# Altium project Carrier-Board-v1.0.PrjPcb (part 4 of 15)

## Sheet MICRO_SD_INTERFACE.SchDoc
size A4; SheetNumber: 7; SheetTotal: 27
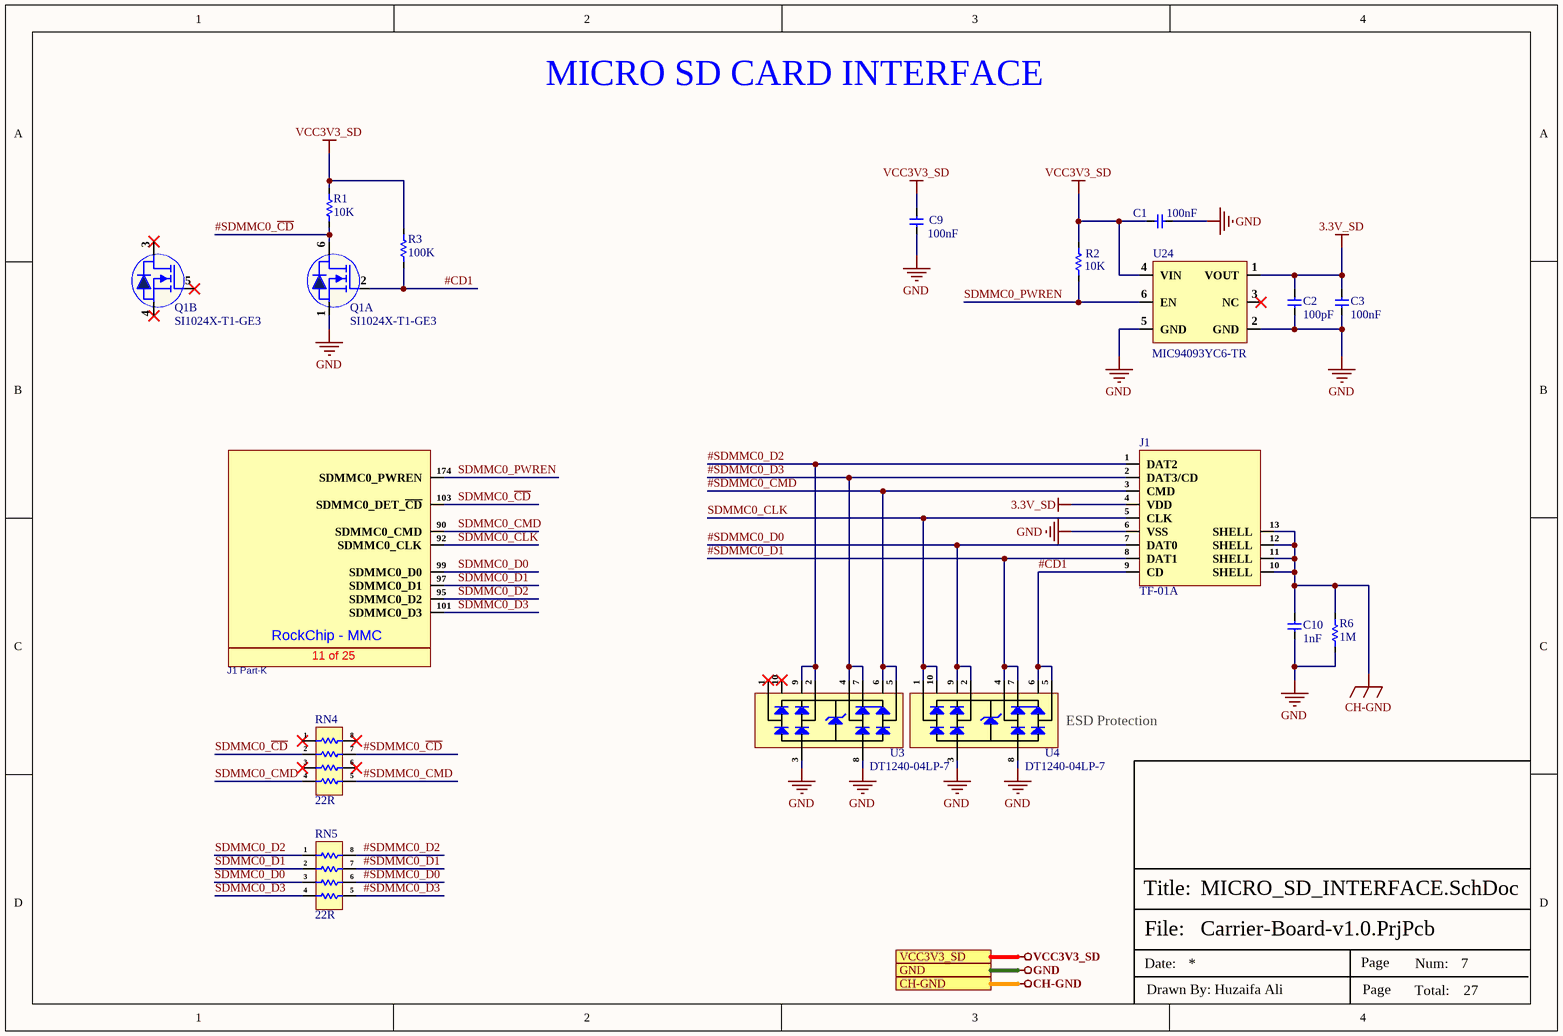
[diagram p6: MICRO_SD_INTERFACE.SchDoc]

### Parts
C1  100nF  [Cap-0402]
C2  100pF  [Cap-0402]
C3  100nF  [Cap-0402]
C9  100nF  [Cap-0402]
C10  1nF  [Cap-1206]
J1  TF-01A  [TF-01A]
J1_Part-  AS0B826-S78B-7H  [AS0B826-S78B-7H]  (value not drawn)  (part K of 25)
Q1  SI1024X-T1-GE3  [SOT-563]  (parts A,B of 2)
R1  10K  [Res-0402]
R2  10K  [Res-0402]
R3  100K  [Res-0402]
R6  1M  [Res-0402]
RN4  22R  [0603x4]
RN5  22R  [0603x4]
U3  DT1240-04LP-7  [U-DFN2510-10]
U4  DT1240-04LP-7  [U-DFN2510-10]
U24  MIC94093YC6-TR  [SC-70-6]

### Ports
CH-GND (see TOP SHEET[2B], ETHERNET_PHY0[4D], ETHERNET_PHY1[4D], HDMI_INTERFACE[3D], USB2.0_INTERFACE[3D], USB3.0_INTERFACE[3D], USB-C_INTERFACE[2D]), GND (see TOP SHEET[2B], AUDIO_INTERFACE[1D], BUCK REGULATOR[3D], DEBUG_UART_INTERFACE[3D], DIGITAL IO_RELAY_SHEET[5D], DUAL_SIM_INTERFACE[3D], ETHERNET_PHY0[4D], ETHERNET_PHY1[4D], GSM_INTERFACE[2D], HDMI_INTERFACE[3D], INPUT_PROTECTION[3D], LINEAR_VOLTAGE_REG[3D], MIPI-DSI DISPLAY[3D], POWER SECTION[3D], PUSH BUTTONs_INTERFACE[3C], RGB_LEDs_INTERFACE[3D], ROCKCHIP_PWR_SUPPLY[1D], ROCKCHIP_SYSTEM_CONTROL[3C], RS232_RS485_INTERFACE[3C], SENSOR_SHEET[3D], USB2.0_INTERFACE[3D], USB3.0_INTERFACE[3D], USB-C_INTERFACE[2D], WIEGAND_INTERFACE[3D], WIFI_BLUETOOTH_SHEET[4C]), VCC3V3_SD (see TOP SHEET[2B], ROCKCHIP_PWR_SUPPLY[1D])

### Nets
3.3V_SD: C2.2 C3.2 J1.4(VDD) U24.1(VOUT)
CH-GND: C10.2 J1.10(SHELL) J1.11(SHELL) J1.12(SHELL) J1.13(SHELL) R6.2 ; port CH-GND
GND: C1.1 C2.1 C3.1 C9.1 C10.1 J1.6(VSS) Q1.1(S1) R6.1 U3.3 U3.8 U4.3 U4.8 U24.2(GND) U24.5(GND) ; port GND
VCC3V3_SD: C1.2 C9.2 R1.2 R2.2 R3.2 U24.4(VIN) ; port VCC3V3_SD
#CD1: J1.9(CD) Q1.2(G1) R3.1 U4.5 U4.6
#SDMMC0_~{CD}: Q1.6(D1) R1.1 RN4.7
#SDMMC0_CMD: J1.3(CMD) RN4.5 U3.5 U3.6
#SDMMC0_D0: J1.7(DAT0) RN5.6 U4.2 U4.9
#SDMMC0_D1: J1.8(DAT1) RN5.7 U4.4 U4.7
#SDMMC0_D2: J1.1(DAT2) RN5.8 U3.2 U3.9
#SDMMC0_D3: J1.2(DAT3/CD) RN5.5 U3.4 U3.7
SDMMC0_~{CD}: J1_Part-.103(SDMMC0_DET_~{CD}) RN4.2
SDMMC0_CLK: J1.5(CLK) J1_Part-.92(SDMMC0_CLK) U4.1 U4.10
SDMMC0_CMD: J1_Part-.90(SDMMC0_CMD) RN4.4
SDMMC0_D0: J1_Part-.99(SDMMC0_D0) RN5.3
SDMMC0_D1: J1_Part-.97(SDMMC0_D1) RN5.2
SDMMC0_D2: J1_Part-.95(SDMMC0_D2) RN5.1
SDMMC0_D3: J1_Part-.101(SDMMC0_D3) RN5.4
SDMMC0_PWREN: J1_Part-.174(SDMMC0_PWREN) R2.1 U24.6(EN)

Not connected (* = marked no-connect by the designer): Q1 3(D2)* 4(S2)* 5(G2)*; RN4 1* 3* 6* 8*; U3 1* 10*; U24 3(NC)*

### Notes on the sheet
- MICRO SD CARD INTERFACE
- (near U4) ESD Protection
- File:
- Title:
- Date:
- Page
- Num:
- Total:
- Drawn By: Huzaifa Ali
- (in symbol AS0B826-S78B-7H, part K) RockChip - MMC; 11 of 25

### Library data of the parts
C1 C3 C9 = CC0402KRX5R7BB104: as C88 on sheet ROCKCHIP_PWR_SUPPLY; Manufacturer Part Number: CC0402KRX5R7BB104; RoHS: Yes; Category: Ceramic Capacitors; Supplier 1: Mouser; Stock 1: 936792; Pricing 1: 1=0.10000, 10=0.02300, 50=0.02300, 100=0.01100, 1000=0.00600, 10000=0.00400 (USD); Mount: Surface Mount; Case/Package: 0402; Number of Pins: 2; Case Code (Metric): 1005; Case Code (Imperial): 0402; Min Operating Temperature: -55°C; Max Operating Temperature: 85°C; Capacitance: 100nF; Dielectric: X5R; Packaging: Tape and Reel; Voltage Rating: 16V; Package Quantity: 1; Voltage Rating (DC): 16V; Termination: SMD/SMT; Resistor Type: Ceramic; Series: CC; Construction: Flat; Length: 1mm; Width: 0.02inch; Height: 0.5mm; Thickness: 0.022inch; Depth: 0.5mm; Radiation Hardening: No; REACH SVHC: Unknown; Lead Free: Lead Free; Halogen Free: Halogen Free; RoHS Compliant: Yes; ComponentLink1URL: https://datasheet.ciiva.com/155/mlccorderingcode-155879.pdf?src-supplier=Digi-Key; ComponentLink1Description: https://datasheet.ciiva.com/155/mlccorderingcode-155879.pdf?src-supplier=Digi-Key; ComponentLink2URL: https://datasheet.ciiva.com/155/mlccorderingcode-155878.pdf?src-supplier=Digi-Key; ComponentLink2Description: https://datasheet.ciiva.com/155/mlccorderingcode-155878.pdf?src-supplier=Digi-Key; ComponentLink3URL: https://datasheet.ciiva.com/155/mlccorderingcode-155880.pdf?src-supplier=Digi-Key; ComponentLink3Description: https://datasheet.ciiva.com/155/mlccorderingcode-155880.pdf?src-supplier=Digi-Key; ComponentLink4URL: https://datasheet.ciiva.com/11464/upy-gphc-x5r-4v-to-50v-12-11464869.pdf?src-supplier=Avnet; ComponentLink4Description: https://datasheet.ciiva.com/11464/upy-gphc-x5r-4v-to-50v-12-11464869.pdf?src-supplier=Avnet; Supplier Part Number 1: 603-CC402KRX5R7BB104; LCSC Part Number: C106204
C2 = CC0402JRNPO9BN101: CAP CER 100PF 50V C0G/NPO 0402; Manufacturer: Yageo; Item Type: Capacitor; Dielectric Material: Ceramic; Tolerance: 5%; Dielectric: C0G; Temperature Coefficient: 30ppm/°C; Insulation Resistance: 100GR; Supplier: Future Electronics; Supplier Part Number: 8934564; Manufacturer Part Number: CC0402JRNPO9BN101; RoHS: Yes; Category: Ceramic Capacitors; Stock: 11720000; Pricing: 10000=0.002, 40000=0.0019, 150000=0.0018, 400000=0.0018, 1000000=0.0017 (USD); ComponentLink1URL: https://datasheet.ciiva.com/11786/0900766b80d84fbf-11786101.pdf?src-supplier=Rs; ComponentLink1Description: https://datasheet.ciiva.com/11786/0900766b80d84fbf-11786101.pdf?src-supplier=Rs; ComponentLink2URL: https://datasheet.ciiva.com/23767/25787-23767888.pdf?src-supplier=Newark; ComponentLink2Description: https://datasheet.ciiva.com/23767/25787-23767888.pdf?src-supplier=Newark; ComponentLink3URL: https://datasheet.ciiva.com/28450/1443161-28450220.pdf?src-supplier=Element14; ComponentLink3Description: https://datasheet.ciiva.com/28450/1443161-28450220.pdf?src-supplier=Element14; ComponentLink4URL: https://datasheet.ciiva.com/8033/1443161-8033598.pdf?src-supplier=Element14; ComponentLink4Description: https://datasheet.ciiva.com/8033/1443161-8033598.pdf?src-supplier=Element14; ComponentLink5URL: https://datasheet.ciiva.com/143/mlccorderingcode-143990.pdf?src-supplier=Digi-Key; ComponentLink5Description: https://datasheet.ciiva.com/143/mlccorderingcode-143990.pdf?src-supplier=Digi-Key; Mounting Technology: Surface Mount; Case/Package: 0402; Pins: 2; Case Code (Imperial): 0402; Case Code (Metric): 1005; Min Operating Temperature: -55°C; Max Operating Temperature: 125°C; Value: 100pF; Voltage Rating: 50V; Voltage Rating (DC): 50V; Packaging: Tape and Reel; Package Quantity: 1; Termination: SMD/SMT; Voltage: 50V; Series: CC; Length: 1mm; Width: 0.02inch; Height: 0.5mm; Thickness: 0.022inch; Depth: 0.5mm; Radiation Hardening: No; RoHS Compliant: Yes; Reach SVHC Compliant: No; Lead Free: Lead Free; ComponentLink6URL: https://datasheet.ciiva.com/143/mlccorderingcode-143989.pdf?src-supplier=Digi-Key; ComponentLink6Description: https://datasheet.ciiva.com/143/mlccorderingcode-143989.pdf?src-supplier=Digi-Key; ComponentLink7URL: https://datasheet.ciiva.com/143/mlccorderingcode-143991.pdf?src-supplier=Digi-Key; ComponentLink7Description: https://datasheet.ciiva.com/143/mlccorderingcode-143991.pdf?src-supplier=Digi-Key; LCSC Part Number: C106200
C10 = CC1206KKX7RDBB102: CAP CER 1000PF 2KV X7R 1206; Manufacturer: Yageo; Tolerance: 10%; Dissipation Factor: 2.5%; Insulation Resistance: 10GR; Item Type: Capacitor; Manufacturer Part Number: CC1206KKX7RDBB102; RoHS: Yes; Category: Ceramic Capacitors; Case/Package: 1206; Case Code (Metric): 3216; Case Code (Imperial): 1206; Min Operating Temperature: -55°C; Max Operating Temperature: 125°C; Voltage Rating: 2kV; Packaging: Tape and Reel; Dielectric: X7R; Termination: SMD/SMT; Voltage Rating (DC): 2kV; Series: CC; Construction: Flat; Length: 3.2mm; RoHS Compliant: Yes; ComponentLink1URL: https://datasheet.ciiva.com/23942/1449957-23942422.pdf?src-supplier=Newark; ComponentLink1Description: https://datasheet.ciiva.com/23942/1449957-23942422.pdf?src-supplier=Newark; ComponentLink2URL: https://datasheet.ciiva.com/186/upy-np0x7r-hv-1kv-to-3kv-4-186736.pdf?src-supplier=Digi-Key; ComponentLink2Description: https://datasheet.ciiva.com/186/upy-np0x7r-hv-1kv-to-3kv-4-186736.pdf?src-supplier=Digi-Key; ComponentLink3URL: https://datasheet.ciiva.com/186/upy-np0x7r-hv-1kv-to-3kv-4-186737.pdf?src-supplier=Digi-Key; ComponentLink3Description: https://datasheet.ciiva.com/186/upy-np0x7r-hv-1kv-to-3kv-4-186737.pdf?src-supplier=Digi-Key; ComponentLink4URL: https://datasheet.ciiva.com/13386/upy-gp-np0-16v-to-50v-8-13386312.pdf?src-supplier=Mouser; ComponentLink4Description: https://datasheet.ciiva.com/13386/upy-gp-np0-16v-to-50v-8-13386312.pdf?src-supplier=Mouser; ComponentLink5URL: https://datasheet.ciiva.com/186/upy-np0x7r-hv-1kv-to-3kv-4-186735.pdf?src-supplier=Digi-Key; ComponentLink5Description: https://datasheet.ciiva.com/186/upy-np0x7r-hv-1kv-to-3kv-4-186735.pdf?src-supplier=Digi-Key; Supplier 1: Digi-Key; Stock 1: 19260; Pricing 1: 1=0.35000, 10=0.24000, 50=0.16780, 100=0.14390, 500=0.10794, 1000=0.09114 (USD); Mount: Surface Mount; Number of Pins: 2; Capacitance: 1nF; Voltage: 2kV; Package Quantity: 1; Resistor Type: Ceramic; Width: 0.063inch; Height: 1.25mm; Depth: 1.6mm; Thickness: 0.057inch; Radiation Hardening: No; REACH SVHC: Unknown; Lead Free: Lead Free; Supplier Part Number 1: 311-1487-1-ND; LCSC Part Number: C23631
J1 = TF-01A: 2mm Deck MicroSD card (TF card) Self bomb SMD SD Card / Memory Card Connector ROHS; Manufacturer: Yuandi; Manufacturer Part Number: TF-01A; Package: SMD; LCSC Part Number: C2889258; Item Type: MicroSD card; ComponentLink1Description: LCSC; ComponentLink1URL: https://www.lcsc.com/product-detail/SD-Card-Memory-Card-Connector_Yuandi-TF-01A_C2889258.html
J1_Part- = AS0B826-S78B-7H: as J1_Part- on sheet ROCKCHIP_PWR_SUPPLY; Supplier: LCSC; Manufacturer Part Number: AS0B826-S78B-7H; RoHS: No; Stock: 4979; Pricing: 1=9.21, 10=8.287, 25=7.8064, 50=7.6064, 100=7.4062 (USD); LCSC Part Number: C426232
Q1 = SI1024X-T1-GE3: Mosfet 2 N-Channel 20V 485mA 250mW Surface Mount SC-89 (SOT-563F); Manufacturer: Vishay Intertech; Manufacturer Part Number: SI1024X-T1-GE3; Package: SOT-563; LCSC Part Number: C86784; Item Type: Mosfet; ComponentLink1Description: Link; ComponentLink1URL: https://www.lcsc.com/product-detail/MOSFETs_Vishay-Intertech-SI1024X-T1-GE3_C86784.html
R1 R2 = RC0402FR-0710KL: RES 10K OHM 1% 1/16W 0402; Manufacturer: Yageo; Max Power Dissipation: 63mW; Temperature Coefficient: 100ppm/°C; Resistance: 10kR; Voltage Rating (DC): 50V; Power Rating: 62.5mW; Item Type: Resistor; Manufacturer Part Number: RC0402FR-0710KL; RoHS: Yes; Category: Chip SMD Resistors; Case/Package: 0402; Case Code (Imperial): 0402; Case Code (Metric): 1005; Min Operating Temperature: -55°C; Max Operating Temperature: 155°C; Features: Moisture Resistant; Packaging: Tape and Reel; Tolerance: 1%; Number of Terminations: 2; Series: RC; RoHS Compliant: Yes; ComponentLink1URL: https://datasheet.ciiva.com/7660/38568-7660787.pdf?src-supplier=Element14; ComponentLink1Description: https://datasheet.ciiva.com/7660/38568-7660787.pdf?src-supplier=Element14; Supplier 1: Mouser; Stock 1: 18648329; Pricing 1: 1=0.10000, 10=0.01400, 50=0.01400, 100=0.00500, 1000=0.00300, 10000=0.00200 (USD); Number of Pins: 2; Resistor Type: Thick Film; Voltage Rating: 50V; Termination: SMD/SMT; Resistance Tolerance: 1%; Construction: Rectangular; Length: 1mm; Width: 0.5mm; Height: 0.32mm; Depth: 0.5mm; Lead Pitch: 0.2mm; REACH SVHC: No SVHC; Lead Free: Lead Free; Military Standard: Not; ComponentLink2URL: https://datasheet.ciiva.com/7849/1686128-7849814.pdf?src-supplier=Element14; ComponentLink2Description: https://datasheet.ciiva.com/7849/1686128-7849814.pdf?src-supplier=Element14; ComponentLink3URL: https://datasheet.ciiva.com/7983/1018594-7983486.pdf?src-supplier=Element14; ComponentLink3Description: https://datasheet.ciiva.com/7983/1018594-7983486.pdf?src-supplier=Element14; ComponentLink4URL: https://datasheet.ciiva.com/22747/1018594-22747512.pdf?src-supplier=Element14; ComponentLink4Description: https://datasheet.ciiva.com/22747/1018594-22747512.pdf?src-supplier=Element14; ComponentLink5URL: https://datasheet.ciiva.com/12667/pyu-rc0402-51-rohs-l-6-r-12667067.pdf?src-supplier=Mouser; ComponentLink5Description: https://datasheet.ciiva.com/12667/pyu-rc0402-51-rohs-l-6-r-12667067.pdf?src-supplier=Mouser; ComponentLink6URL: https://datasheet.ciiva.com/7849/1784430-7849813.pdf?src-supplier=Element14; ComponentLink6Description: https://datasheet.ciiva.com/7849/1784430-7849813.pdf?src-supplier=Element14; Supplier Part Number 1: 603-RC0402FR-0710KL; LCSC Part Number: C60490; Working Voltage: 50V; ComponentLink7URL: https://datasheet.ciiva.com/7849/1784430-7849815.pdf?src-supplier=Element14; ComponentLink7Description: https://datasheet.ciiva.com/7849/1784430-7849815.pdf?src-supplier=Element14
R3 = RC0402FR-07100KL: RES 100K OHM 1% 1/16W 0402; Manufacturer: Yageo; Temperature Coefficient: 100ppm/°C; Power Rating: 63mW; Voltage Rating: 50V; Item Type: Resistor; Resistance: 100kR; RoHS: Yes; Category: Chip SMD Resistors; Case/Package: 0402; Case Code (Imperial): 0402; Case Code (Metric): 1005; Min Operating Temperature: -55°C; Max Operating Temperature: 155°C; Tolerance: 1%; Resistor Type: Thick Film; Packaging: Tape and Reel; Features: Moisture Resistant; Resistance Tolerance: 1%; Height: 0.016inch; Lead Free: Lead Free; RoHS Compliant: Yes; ComponentLink1Description: https://datasheet.ciiva.com/11819/0900766b80c66297-11819452.pdf?src-supplier=RSComponents; ComponentLink1URL: https://datasheet.ciiva.com/11819/0900766b80c66297-11819452.pdf?src-supplier=RSComponents; ComponentLink2URL: https://datasheet.ciiva.com/22747/1018594-22747509.pdf?src-supplier=Element14; ComponentLink2Description: https://datasheet.ciiva.com/22747/1018594-22747509.pdf?src-supplier=Element14; ComponentLink3URL: https://datasheet.ciiva.com/2453/pyu-r-int-thick-7-2453362.pdf?src-supplier=Digi-Key; ComponentLink3Description: https://datasheet.ciiva.com/2453/pyu-r-int-thick-7-2453362.pdf?src-supplier=Digi-Key; ComponentLink4URL: https://datasheet.ciiva.com/2453/pyu-r-int-thick-7-2453363.pdf?src-supplier=Digi-Key; ComponentLink4Description: https://datasheet.ciiva.com/2453/pyu-r-int-thick-7-2453363.pdf?src-supplier=Digi-Key; ComponentLink5URL: https://datasheet.ciiva.com/2453/pyu-r-int-thick-7-2453361.pdf?src-supplier=Digi-Key; ComponentLink5Description: https://datasheet.ciiva.com/2453/pyu-r-int-thick-7-2453361.pdf?src-supplier=Digi-Key; ComponentLink6URL: https://datasheet.ciiva.com/12667/pyu-rc0402-51-rohs-l-6-r-12667930.pdf?src-supplier=Mouser; ComponentLink6Description: https://datasheet.ciiva.com/12667/pyu-rc0402-51-rohs-l-6-r-12667930.pdf?src-supplier=Mouser; ComponentLink7URL: https://datasheet.ciiva.com/15189/getdatasheetpartid-323696-15189334.pdf?src-supplier=Verical; ComponentLink7Description: https://datasheet.ciiva.com/15189/getdatasheetpartid-323696-15189334.pdf?src-supplier=Verical; LCSC Part Number: C60491; Supplier 1: Mouser; Manufacturer Part Number: RC0402FR-07100KL; Stock 1: 7759549; Pricing 1: 1=0.10000, 10=0.01200, 50=0.01200, 100=0.00500, 1000=0.00300, 2500=0.00200, 10000=0.00100 (USD); Package Quantity: 1; Number of Terminations: 2; Termination: SMD/SMT; Max Power Dissipation: 63mW; Working Voltage: 50V; Series: RC; Construction: Rectangular; Technology: THICK FILM; Length: 0.039inch; Width: 0.02inch; Depth: 0.5mm; REACH SVHC: No SVHC; Military Standard: Not; Supplier Part Number 1: 603-RC0402FR-07100KL
R6 = AF0402JR-071ML: RES SMD 1M OHM 5% 1/16W 0402; Manufacturer: Yageo; Temperature Coefficient: 100ppm/°C; Resistance: 1MR; Item Type: Resistor; Max Power Dissipation: 63mW; Manufacturer Part Number: AF0402JR-071ML; Case/Package: 0402; Min Operating Temperature: -55°C; Max Operating Temperature: 155°C; Packaging: Tape and Reel; Tolerance: 5%; Height: 0.015inch; ComponentLink1URL: https://www.yageo.com/upload/media/product/productsearch/datasheet/rchip/PYu-AF_51_RoHS_L_6.pdf?src-supplier=Digi-Key; ComponentLink1Description: https://www.yageo.com/upload/media/product/productsearch/datasheet/rchip/PYu-AF_51_RoHS_L_6.pdf?src-supplier=Digi-Key; Supplier 1: Digi-Key; Stock 1: 0; Pricing 1: 10000=0.00408 (USD); Length: 0.039inch; Width: 0.02inch; Supplier Part Number 1: AF0402JR-071ML-ND; LCSC Part Number: C144054; Resistor Type: Thick Film; Number of Terminations: 2; Features: Moisture Resistant,Anti-Sulfur; RoHS Compliant: Yes
RN4 RN5 = YC164-FR-0722RL: RES ARRAY 4 RES 22 OHM 1206; Manufacturer: YAGEO; Item Type: Resistor; Manufacturer Part Number: YC164-FR-0722RL; Package: 0604x4; LCSC Part Number: C728877; ComponentLink1Description: LCSC; ComponentLink1URL: https://www.lcsc.com/product-detail/Resistor-Networks-Arrays_YAGEO-YC164-FR-0722RL_C728877.html
U3 U4 = DT1240-04LP-7: TVS DIODE 5.5VWM 11VC U-DFN2510; Manufacturer: Diodes; Supplier: Digi-Key; Supplier Part Number: DT1240-04LP-7DICT-ND; Manufacturer Part Number: DT1240-04LP-7; RoHS: Yes; Category: TVS Diodes; Stock: 985; Pricing: 1=0.46, 10=0.319, 100=0.1612, 500=0.1315, 1000=0.09757 (USD); ComponentLink1URL: https://datasheet.ciiva.com/29574/dt1240-04lp-29574117.pdf?src-supplier=Digi-Key; ComponentLink1Description: https://datasheet.ciiva.com/29574/dt1240-04lp-29574117.pdf?src-supplier=Digi-Key; ComponentLink2URL: https://datasheet.ciiva.com/48480/dt1240-04lp-48480037.pdf?src-supplier=Avnet; ComponentLink2Description: https://datasheet.ciiva.com/48480/dt1240-04lp-48480037.pdf?src-supplier=Avnet; ComponentLink3URL: https://datasheet.ciiva.com/29574/dt1240-04lp-29574118.pdf?src-supplier=Digi-Key; ComponentLink3Description: https://datasheet.ciiva.com/29574/dt1240-04lp-29574118.pdf?src-supplier=Digi-Key; ComponentLink4URL: https://datasheet.ciiva.com/29574/dt1240-04lp-29574119.pdf?src-supplier=Digi-Key; ComponentLink4Description: https://datasheet.ciiva.com/29574/dt1240-04lp-29574119.pdf?src-supplier=Digi-Key
U24 = MIC94093YC6-TR: Power Switch/Driver 1:1 P-Channel 1.7V~5.5V 130mΩ 1.2A SC-70-6; Manufacturer: Microchip Tech; Item Type: IC; Manufacturer Part Number: MIC94093YC6-TR; Package: SC-70-6; LCSC Part Number: C626244; ComponentLink1Description: LCSC; ComponentLink1URL: https://www.lcsc.com/product-detail/Power-Distribution-Switches_Microchip-Tech-MIC94093YC6-TR_C626244.html

## Sheet HDMI_INTERFACE.SchDoc
size A4; SheetNumber: 8; SheetTotal: 27
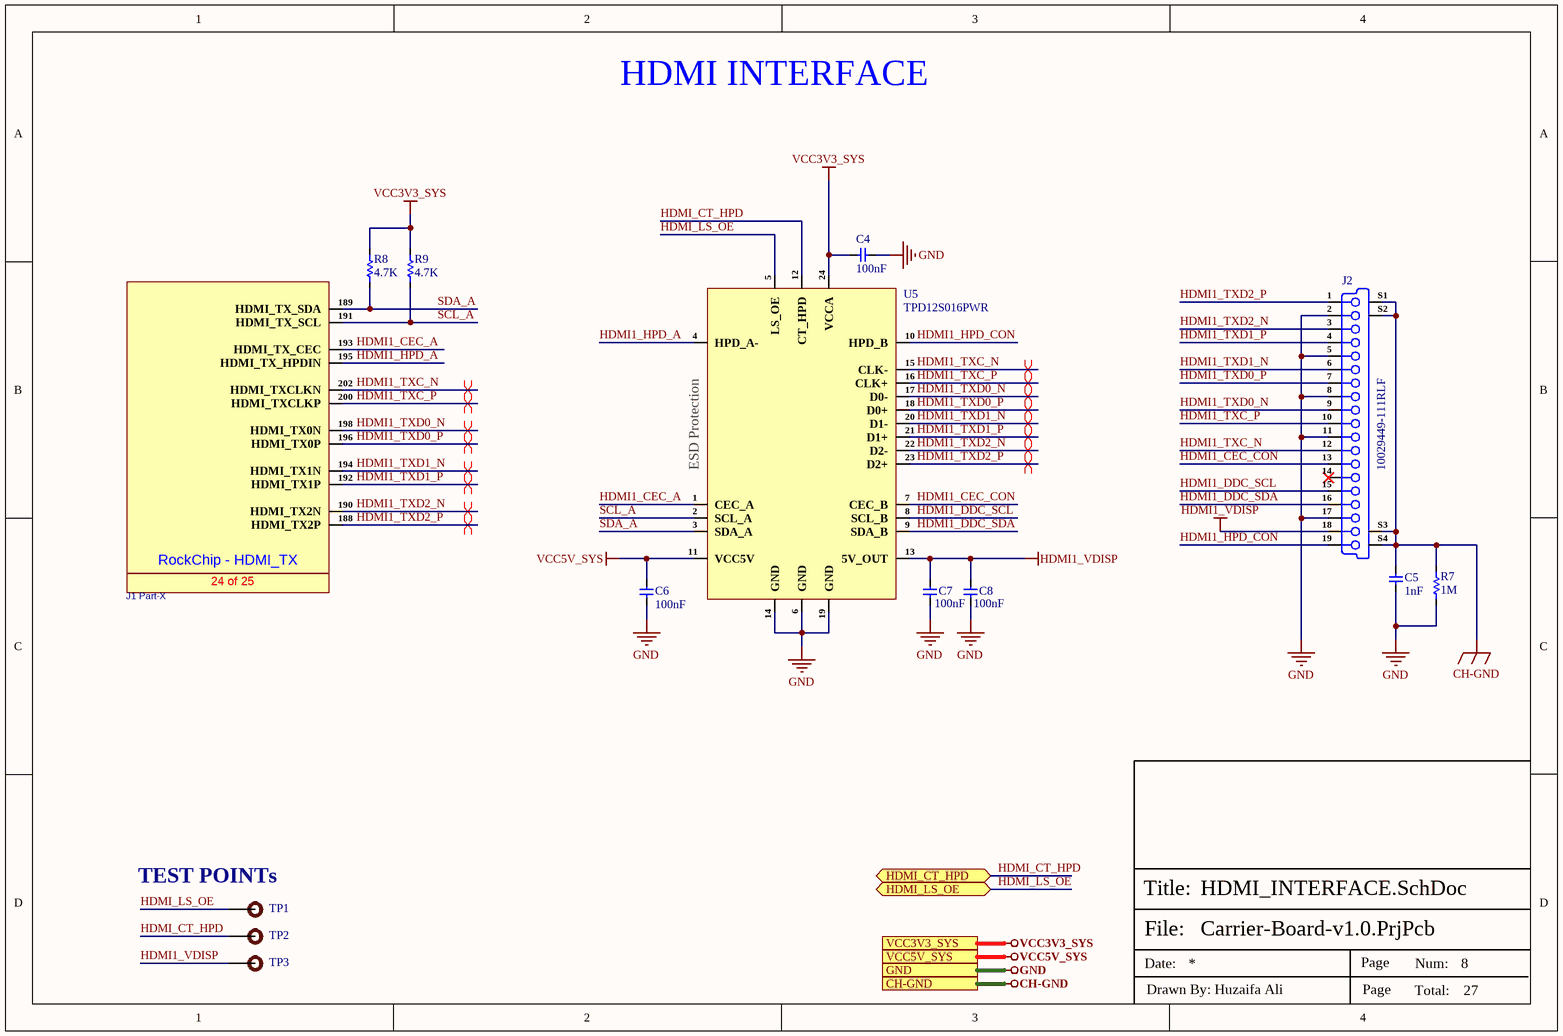
[diagram p7: HDMI_INTERFACE.SchDoc]

### Parts
C4  100nF  [Cap-0402]
C5  1nF  [Cap-1206]
C6  100nF  [Cap-0402]
C7  100nF  [Cap-0402]
C8  100nF  [Cap-0402]
J1_Part-  AS0B826-S78B-7H  [AS0B826-S78B-7H]  (value not drawn)  (part X of 25)
J2  10029449-111RLF  [10029449-111RLF]
R7  1M  [Res-0402]
R8  4.7K  [Res-0402]
R9  4.7K  [Res-0402]
TP1  TEST POINT 0.5mm Dia  [Test-point - 0.5mm]  (value not drawn)  (no BOM)
TP2  TEST POINT 0.5mm Dia  [Test-point - 0.5mm]  (value not drawn)  (no BOM)
TP3  TEST POINT 0.5mm Dia  [Test-point - 0.5mm]  (value not drawn)  (no BOM)
U5  TPD12S016PWR  [24-TSSOP]

### Ports
CH-GND (see TOP SHEET[2C], ETHERNET_PHY0[4D], ETHERNET_PHY1[4D], MICRO_SD_INTERFACE[3D], USB2.0_INTERFACE[3D], USB3.0_INTERFACE[3D], USB-C_INTERFACE[2D]), GND (see TOP SHEET[2C], AUDIO_INTERFACE[1D], BUCK REGULATOR[3D], DEBUG_UART_INTERFACE[3D], DIGITAL IO_RELAY_SHEET[5D], DUAL_SIM_INTERFACE[3D], ETHERNET_PHY0[4D], ETHERNET_PHY1[4D], GSM_INTERFACE[2D], INPUT_PROTECTION[3D], LINEAR_VOLTAGE_REG[3D], MICRO_SD_INTERFACE[3D], MIPI-DSI DISPLAY[3D], POWER SECTION[3D], PUSH BUTTONs_INTERFACE[3C], RGB_LEDs_INTERFACE[3D], ROCKCHIP_PWR_SUPPLY[1D], ROCKCHIP_SYSTEM_CONTROL[3C], RS232_RS485_INTERFACE[3C], SENSOR_SHEET[3D], USB2.0_INTERFACE[3D], USB3.0_INTERFACE[3D], USB-C_INTERFACE[2D], WIEGAND_INTERFACE[3D], WIFI_BLUETOOTH_SHEET[4C]), HDMI_CT_HPD (bidir, see TOP SHEET[2C], ROCKCHIP_GPIO_NC PINS[2D]), HDMI_LS_OE (bidir, see TOP SHEET[2C], ROCKCHIP_GPIO_NC PINS[2D]), VCC3V3_SYS (see TOP SHEET[2C], AUDIO_INTERFACE[1D], BUCK REGULATOR[3D], DEBUG_UART_INTERFACE[3D], DIGITAL IO_RELAY_SHEET[5D], ETHERNET_PHY0[4D], ETHERNET_PHY1[4D], GSM_INTERFACE[2D], LINEAR_VOLTAGE_REG[3D], MIPI-DSI DISPLAY[3D], POWER SECTION[3D], PUSH BUTTONs_INTERFACE[3C], ROCKCHIP_PWR_SUPPLY[1D], ROCKCHIP_SYSTEM_CONTROL[3C], RS232_RS485_INTERFACE[3C], SENSOR_SHEET[3D], USB-C_INTERFACE[2D], WIEGAND_INTERFACE[3D], WIFI_BLUETOOTH_SHEET[4C]), VCC5V_SYS (see TOP SHEET[2C], BUCK REGULATOR[3D], DIGITAL IO_RELAY_SHEET[5D], LINEAR_VOLTAGE_REG[3D], MIPI-DSI DISPLAY[3D], POWER SECTION[3D], RGB_LEDs_INTERFACE[3D], ROCKCHIP_PWR_SUPPLY[1D], USB2.0_INTERFACE[3D], USB3.0_INTERFACE[3D], USB-C_INTERFACE[2D], WIEGAND_INTERFACE[3D])

### Nets
CH-GND: C5.2 J2.S1(Shield) J2.S2(Shield) J2.S3(Shield) J2.S4(Shield) R7.2 ; port CH-GND
GND: C4.1 C5.1 C6.2 C7.2 C8.2 J2.2 J2.5 J2.8 J2.11 J2.17 R7.1 U5.6(GND) U5.14(GND) U5.19(GND) ; port GND
HDMI1_VDISP: C7.1 C8.1 J2.18 TP3.1 U5.13(5V_OUT)
VCC3V3_SYS: C4.2 R8.1 R9.1 U5.24(VCCA) ; port VCC3V3_SYS
VCC5V_SYS: C6.1 U5.11(VCC5V) ; port VCC5V_SYS
HDMI1_CEC_A: J1_Part-.193(HDMI_TX_CEC) U5.1(CEC_A)
HDMI1_CEC_CON: J2.13 U5.7(CEC_B)
HDMI1_DDC_SCL: J2.15 U5.8(SCL_B)
HDMI1_DDC_SDA: J2.16 U5.9(SDA_B)
HDMI1_HPD_A: J1_Part-.195(HDMI_TX_HPDIN) U5.4(HPD_A-)
HDMI1_HPD_CON: J2.19 U5.10(HPD_B)
HDMI1_TXC_N: J1_Part-.202(HDMI_TXCLKN) J2.12 U5.15(CLK-)
HDMI1_TXC_P: J1_Part-.200(HDMI_TXCLKP) J2.10 U5.16(CLK+)
HDMI1_TXD0_N: J1_Part-.198(HDMI_TX0N) J2.9 U5.17(D0-)
HDMI1_TXD0_P: J1_Part-.196(HDMI_TX0P) J2.7 U5.18(D0+)
HDMI1_TXD1_N: J1_Part-.194(HDMI_TX1N) J2.6 U5.20(D1-)
HDMI1_TXD1_P: J1_Part-.192(HDMI_TX1P) J2.4 U5.21(D1+)
HDMI1_TXD2_N: J1_Part-.190(HDMI_TX2N) J2.3 U5.22(D2-)
HDMI1_TXD2_P: J1_Part-.188(HDMI_TX2P) J2.1 U5.23(D2+)
HDMI_CT_HPD: TP2.1 U5.12(CT_HPD) ; port HDMI_CT_HPD
HDMI_LS_OE: TP1.1 U5.5(LS_OE) ; port HDMI_LS_OE
SCL_A: J1_Part-.191(HDMI_TX_SCL) R9.2 U5.2(SCL_A)
SDA_A: J1_Part-.189(HDMI_TX_SDA) R8.2 U5.3(SDA_A)

Not connected (* = marked no-connect by the designer): J2 14*

### Layout directives
differential pair; differential pair class DIFF_HDMI_100; rule Matched Net Lengths [Tolerance = 0.508mm]; rule Impedance Constraint [Min = 98.00    Max = 102.0    ]: HDMI1_TXC_N, HDMI1_TXC_P, HDMI1_TXD0_N, HDMI1_TXD0_P, HDMI1_TXD1_N, HDMI1_TXD1_P, HDMI1_TXD2_N, HDMI1_TXD2_P

### Notes on the sheet
- HDMI INTERFACE
- (near U5) ESD Protection
- (near TP1) TEST POINTs
- File:
- Title:
- Date:
- Page
- Num:
- Total:
- Drawn By: Huzaifa Ali
- (in symbol AS0B826-S78B-7H, part X) RockChip - HDMI_TX; 24 of 25

### Library data of the parts
C4 C6-C8 = CC0402KRX5R7BB104: as C88 on sheet ROCKCHIP_PWR_SUPPLY; Manufacturer Part Number: CC0402KRX5R7BB104; RoHS: Yes; Category: Ceramic Capacitors; Supplier 1: Mouser; Stock 1: 936792; Pricing 1: 1=0.10000, 10=0.02300, 50=0.02300, 100=0.01100, 1000=0.00600, 10000=0.00400 (USD); Mount: Surface Mount; Case/Package: 0402; Number of Pins: 2; Case Code (Metric): 1005; Case Code (Imperial): 0402; Min Operating Temperature: -55°C; Max Operating Temperature: 85°C; Capacitance: 100nF; Dielectric: X5R; Packaging: Tape and Reel; Voltage Rating: 16V; Package Quantity: 1; Voltage Rating (DC): 16V; Termination: SMD/SMT; Resistor Type: Ceramic; Series: CC; Construction: Flat; Length: 1mm; Width: 0.02inch; Height: 0.5mm; Thickness: 0.022inch; Depth: 0.5mm; Radiation Hardening: No; REACH SVHC: Unknown; Lead Free: Lead Free; Halogen Free: Halogen Free; RoHS Compliant: Yes; ComponentLink1URL: https://datasheet.ciiva.com/155/mlccorderingcode-155879.pdf?src-supplier=Digi-Key; ComponentLink1Description: https://datasheet.ciiva.com/155/mlccorderingcode-155879.pdf?src-supplier=Digi-Key; ComponentLink2URL: https://datasheet.ciiva.com/155/mlccorderingcode-155878.pdf?src-supplier=Digi-Key; ComponentLink2Description: https://datasheet.ciiva.com/155/mlccorderingcode-155878.pdf?src-supplier=Digi-Key; ComponentLink3URL: https://datasheet.ciiva.com/155/mlccorderingcode-155880.pdf?src-supplier=Digi-Key; ComponentLink3Description: https://datasheet.ciiva.com/155/mlccorderingcode-155880.pdf?src-supplier=Digi-Key; ComponentLink4URL: https://datasheet.ciiva.com/11464/upy-gphc-x5r-4v-to-50v-12-11464869.pdf?src-supplier=Avnet; ComponentLink4Description: https://datasheet.ciiva.com/11464/upy-gphc-x5r-4v-to-50v-12-11464869.pdf?src-supplier=Avnet; Supplier Part Number 1: 603-CC402KRX5R7BB104; LCSC Part Number: C106204
C5 = CC1206KKX7RDBB102: as C10 on sheet MICRO_SD_INTERFACE; Manufacturer Part Number: CC1206KKX7RDBB102; RoHS: Yes; Category: Ceramic Capacitors; Case/Package: 1206; Case Code (Metric): 3216; Case Code (Imperial): 1206; Min Operating Temperature: -55°C; Max Operating Temperature: 125°C; Voltage Rating: 2kV; Packaging: Tape and Reel; Dielectric: X7R; Termination: SMD/SMT; Voltage Rating (DC): 2kV; Series: CC; Construction: Flat; Length: 3.2mm; RoHS Compliant: Yes; ComponentLink1URL: https://datasheet.ciiva.com/23942/1449957-23942422.pdf?src-supplier=Newark; ComponentLink1Description: https://datasheet.ciiva.com/23942/1449957-23942422.pdf?src-supplier=Newark; ComponentLink2URL: https://datasheet.ciiva.com/186/upy-np0x7r-hv-1kv-to-3kv-4-186736.pdf?src-supplier=Digi-Key; ComponentLink2Description: https://datasheet.ciiva.com/186/upy-np0x7r-hv-1kv-to-3kv-4-186736.pdf?src-supplier=Digi-Key; ComponentLink3URL: https://datasheet.ciiva.com/186/upy-np0x7r-hv-1kv-to-3kv-4-186737.pdf?src-supplier=Digi-Key; ComponentLink3Description: https://datasheet.ciiva.com/186/upy-np0x7r-hv-1kv-to-3kv-4-186737.pdf?src-supplier=Digi-Key; ComponentLink4URL: https://datasheet.ciiva.com/13386/upy-gp-np0-16v-to-50v-8-13386312.pdf?src-supplier=Mouser; ComponentLink4Description: https://datasheet.ciiva.com/13386/upy-gp-np0-16v-to-50v-8-13386312.pdf?src-supplier=Mouser; ComponentLink5URL: https://datasheet.ciiva.com/186/upy-np0x7r-hv-1kv-to-3kv-4-186735.pdf?src-supplier=Digi-Key; ComponentLink5Description: https://datasheet.ciiva.com/186/upy-np0x7r-hv-1kv-to-3kv-4-186735.pdf?src-supplier=Digi-Key; Supplier 1: Digi-Key; Stock 1: 19260; Pricing 1: 1=0.35000, 10=0.24000, 50=0.16780, 100=0.14390, 500=0.10794, 1000=0.09114 (USD); Mount: Surface Mount; Number of Pins: 2; Capacitance: 1nF; Voltage: 2kV; Package Quantity: 1; Resistor Type: Ceramic; Width: 0.063inch; Height: 1.25mm; Depth: 1.6mm; Thickness: 0.057inch; Radiation Hardening: No; REACH SVHC: Unknown; Lead Free: Lead Free; Supplier Part Number 1: 311-1487-1-ND; LCSC Part Number: C23631
J1_Part- = AS0B826-S78B-7H: as J1_Part- on sheet ROCKCHIP_PWR_SUPPLY; Supplier: LCSC; Manufacturer Part Number: AS0B826-S78B-7H; RoHS: No; Stock: 4979; Pricing: 1=9.21, 10=8.287, 25=7.8064, 50=7.6064, 100=7.4062 (USD); LCSC Part Number: C426232
J2 = 10029449-111RLF: CONN RCPT 1.4 HDMI 19POS SMD R/A; Manufacturer: Amphenol ICC / FCI; Item Type: HDMI Connector; Supplier 1: RSComponents; Manufacturer Part Number: 10029449-111RLF; RoHS: No; Category: Audio / Video Connectors; Stock 1: 6150; Pricing 1: 1=1471.56000 (GBP); ComponentLink1URL: https://www.verical.com/server-webapp/html/getDatasheet?partID=416866&src-supplier=Verical; ComponentLink1Description: https://www.verical.com/server-webapp/html/getDatasheet?partID=416866&src-supplier=Verical; ComponentLink2URL: http://components.arrow.com/part/dataview/51683435S9285512N8314?src-supplier=Arrow+Electronics; ComponentLink2Description: http://components.arrow.com/part/dataview/51683435S9285512N8314?src-supplier=Arrow+Electronics; ComponentLink3URL: http://portal.fciconnect.com/Comergent/en/US/adirect/fci?cmd=catProductDetail&showAddButton=true&productID=10029449111RLF&src-supplier=Mouser; ComponentLink3Description: http://portal.fciconnect.com/Comergent/en/US/adirect/fci?cmd=catProductDetail&showAddButton=true&productID=10029449111RLF&src-supplier=Mouser; ComponentLink4URL: http://www.amphenol-icc.com/media/wysiwyg/files/drawing/10029449.pdf?src-supplier=Digi-Key; ComponentLink4Description: http://www.amphenol-icc.com/media/wysiwyg/files/drawing/10029449.pdf?src-supplier=Digi-Key; ComponentLink5URL: http://www.farnell.com/datasheets/2562284.pdf?src-supplier=Farnell; ComponentLink5Description: http://www.farnell.com/datasheets/2562284.pdf?src-supplier=Farnell; Supplier Part Number 1: 1822113; LCSC Part Number: C427307
R7 = AF0402JR-071ML: as R6 on sheet MICRO_SD_INTERFACE; Manufacturer Part Number: AF0402JR-071ML; Case/Package: 0402; Min Operating Temperature: -55°C; Max Operating Temperature: 155°C; Packaging: Tape and Reel; Tolerance: 5%; Height: 0.015inch; ComponentLink1URL: https://www.yageo.com/upload/media/product/productsearch/datasheet/rchip/PYu-AF_51_RoHS_L_6.pdf?src-supplier=Digi-Key; ComponentLink1Description: https://www.yageo.com/upload/media/product/productsearch/datasheet/rchip/PYu-AF_51_RoHS_L_6.pdf?src-supplier=Digi-Key; Supplier 1: Digi-Key; Stock 1: 0; Pricing 1: 10000=0.00408 (USD); Length: 0.039inch; Width: 0.02inch; Supplier Part Number 1: AF0402JR-071ML-ND; LCSC Part Number: C144054; Resistor Type: Thick Film; Number of Terminations: 2; Features: Moisture Resistant,Anti-Sulfur; RoHS Compliant: Yes
R8 R9 = RC0402FR-074K7L: RES 4.7K OHM 1% 1/16W 0402; Manufacturer: Yageo; Voltage Rating (DC): 50V; Power Rating: 62.5mW; Resistance: 4.7kR; Temperature Coefficient: 100ppm/°C; Max Power Dissipation: 63mW; Item Type: Resistor; Manufacturer Part Number: RC0402FR-074K7L; RoHS: Yes; Category: Chip SMD Resistors; ComponentLink1URL: https://datasheet.ciiva.com/22661/1686128-22661342.pdf?src-supplier=Element14; ComponentLink1Description: https://datasheet.ciiva.com/22661/1686128-22661342.pdf?src-supplier=Element14; ComponentLink2URL: https://datasheet.ciiva.com/7850/1018594-7850022.pdf?src-supplier=Element14; ComponentLink2Description: https://datasheet.ciiva.com/7850/1018594-7850022.pdf?src-supplier=Element14; ComponentLink3URL: https://datasheet.ciiva.com/7850/1018594-7850023.pdf?src-supplier=Element14; ComponentLink3Description: https://datasheet.ciiva.com/7850/1018594-7850023.pdf?src-supplier=Element14; ComponentLink4URL: https://datasheet.ciiva.com/15215/getdatasheetpartid-328119-15215035.pdf?src-supplier=Verical; ComponentLink4Description: https://datasheet.ciiva.com/15215/getdatasheetpartid-328119-15215035.pdf?src-supplier=Verical; Supplier 1: Avnet; Stock 1: 2420000; Pricing 1: 10000=0.00085 (USD); Case/Package: 0402; Number of Pins: 2; Case Code (Imperial): 0402; Case Code (Metric): 1005; Size Code: 0402; Min Operating Temperature: -55°C; Max Operating Temperature: 155°C; Tolerance: 1%; Voltage Rating: 50V; Packaging: Tape and Reel; Resistor Type: Thick Film; Termination: SMD/SMT; Features: Moisture Resistant; Series: RC; Number of Terminations: 2; Resistance Tolerance: 1%; Construction: Rectangular; Length: 1mm; Width: 0.5mm; Height: 0.32mm; Depth: 0.5mm; Height - Seated (Max): 0.016inch; RoHS Compliant: Yes; Reach SVHC Compliant: Yes; Military Standard: Not; Lead Free: Lead Free; Supplier Part Number 1: RC0402FR-074K7L; LCSC Part Number: C105871
TP1-TP3 = TEST POINT 0.5mm Dia: Test Point ON; Item Type: Test Point; Manufacturer Part Number: TEST POINT 0.5mm Dia
U5 = TPD12S016PWR: IC INTERFACE SPECIALIZED 24TSSOP; Manufacturer: Texas Instruments; Supplier: Mouser; Supplier Part Number: 595-TPD12S016PWR; Manufacturer Part Number: TPD12S016PWR; RoHS: Yes; Category: Interface ICs; Stock: 8312; Pricing: 1=1.23, 10=1.11, 50=1.05, 100=0.863, 1000=0.563, 10000=0.495 (USD); ComponentLink1URL: https://datasheet.ciiva.com/1784/tpd12s016-1784288.pdf?src-supplier=Digi-Key; ComponentLink1Description: https://datasheet.ciiva.com/1784/tpd12s016-1784288.pdf?src-supplier=Digi-Key; ComponentLink2URL: https://datasheet.ciiva.com/1495/1506096-1495817.pdf?src-supplier=Element14; ComponentLink2Description: https://datasheet.ciiva.com/1495/1506096-1495817.pdf?src-supplier=Element14; ComponentLink3URL: https://datasheet.ciiva.com/26911/getdatasheetpartid-349978-26911477.pdf?src-supplier=Verical; ComponentLink3Description: https://datasheet.ciiva.com/26911/getdatasheetpartid-349978-26911477.pdf?src-supplier=Verical; ComponentLink4URL: https://datasheet.ciiva.com/41460/001188042-da-01-en-ic-hdmi-esd-pr-tpd12s016pwr-tssop-24-tid-41460279.pdf?src-supplier=Conrad; ComponentLink4Description: https://datasheet.ciiva.com/41460/001188042-da-01-en-ic-hdmi-esd-pr-tpd12s016pwr-tssop-24-tid-41460279.pdf?src-supplier=Conrad; ComponentLink5URL: https://datasheet.ciiva.com/3149/tpd12s016-3149560.pdf?src-supplier=Avnet; ComponentLink5Description: https://datasheet.ciiva.com/3149/tpd12s016-3149560.pdf?src-supplier=Avnet

## Sheet MIPI-DSI DISPLAY.SchDoc
size A4; SheetNumber: 9; SheetTotal: 27
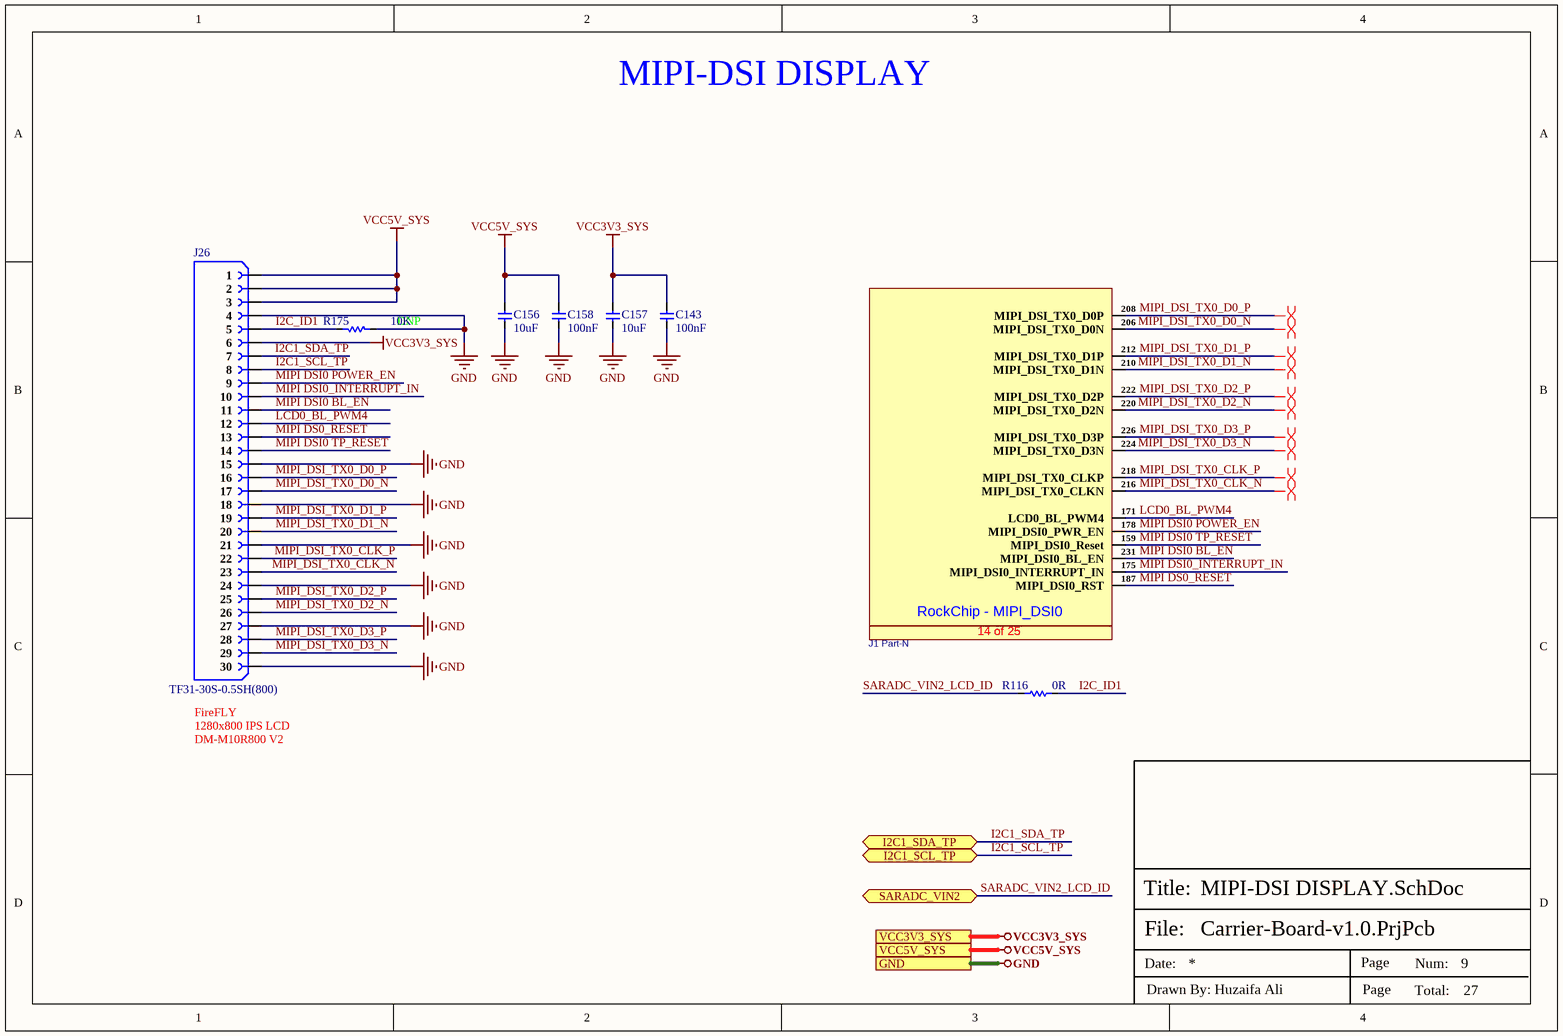
[diagram p8: MIPI-DSI DISPLAY.SchDoc]

### Parts
C143  100nF  [Cap-0402]
C156  10uF  [Cap-0603]
C157  10uF  [Cap-0603]
C158  100nF  [Cap-0402]
J1_Part-  AS0B826-S78B-7H  [AS0B826-S78B-7H]  (value not drawn)  (part N of 25)
J26  TF31-30S-0.5SH(800)  [TF31-30S-0.5SH(800)]
R116  0R  [Res-0402]
R175  DNP  [Res-0402]

### Ports
GND (see TOP SHEET[2B], AUDIO_INTERFACE[1D], BUCK REGULATOR[3D], DEBUG_UART_INTERFACE[3D], DIGITAL IO_RELAY_SHEET[5D], DUAL_SIM_INTERFACE[3D], ETHERNET_PHY0[4D], ETHERNET_PHY1[4D], GSM_INTERFACE[2D], HDMI_INTERFACE[3D], INPUT_PROTECTION[3D], LINEAR_VOLTAGE_REG[3D], MICRO_SD_INTERFACE[3D], POWER SECTION[3D], PUSH BUTTONs_INTERFACE[3C], RGB_LEDs_INTERFACE[3D], ROCKCHIP_PWR_SUPPLY[1D], ROCKCHIP_SYSTEM_CONTROL[3C], RS232_RS485_INTERFACE[3C], SENSOR_SHEET[3D], USB2.0_INTERFACE[3D], USB3.0_INTERFACE[3D], USB-C_INTERFACE[2D], WIEGAND_INTERFACE[3D], WIFI_BLUETOOTH_SHEET[4C]), I2C1_SCL_TP (bidir, see TOP SHEET[2B], DIGITAL IO_RELAY_SHEET[5D]), I2C1_SDA_TP (bidir, see TOP SHEET[2B], DIGITAL IO_RELAY_SHEET[5C]), SARADC_VIN2 (bidir, see TOP SHEET[2B], ROCKCHIP_GPIO_NC PINS[3C], ROCKCHIP_SYSTEM_CONTROL[3C]), VCC3V3_SYS (see TOP SHEET[2B], AUDIO_INTERFACE[1D], BUCK REGULATOR[3D], DEBUG_UART_INTERFACE[3D], DIGITAL IO_RELAY_SHEET[5D], ETHERNET_PHY0[4D], ETHERNET_PHY1[4D], GSM_INTERFACE[2D], HDMI_INTERFACE[3D], LINEAR_VOLTAGE_REG[3D], POWER SECTION[3D], PUSH BUTTONs_INTERFACE[3C], ROCKCHIP_PWR_SUPPLY[1D], ROCKCHIP_SYSTEM_CONTROL[3C], RS232_RS485_INTERFACE[3C], SENSOR_SHEET[3D], USB-C_INTERFACE[2D], WIEGAND_INTERFACE[3D], WIFI_BLUETOOTH_SHEET[4C]), VCC5V_SYS (see TOP SHEET[2B], BUCK REGULATOR[3D], DIGITAL IO_RELAY_SHEET[5D], HDMI_INTERFACE[3D], LINEAR_VOLTAGE_REG[3D], POWER SECTION[3D], RGB_LEDs_INTERFACE[3D], ROCKCHIP_PWR_SUPPLY[1D], USB2.0_INTERFACE[3D], USB3.0_INTERFACE[3D], USB-C_INTERFACE[2D], WIEGAND_INTERFACE[3D])

### Nets
GND: C143.1 C156.1 C157.1 C158.1 J26.4 J26.15 J26.18 J26.21 J26.24 J26.27 J26.30 R175.1 ; port GND
VCC3V3_SYS: C143.2 C157.2 J26.6 ; port VCC3V3_SYS
VCC5V_SYS: C156.2 C158.2 J26.1 J26.2 J26.3 ; port VCC5V_SYS
I2C1_SCL_TP: J26.8 ; port I2C1_SCL_TP
I2C1_SDA_TP: J26.7 ; port I2C1_SDA_TP
I2C_ID1: J26.5 R116.2 R175.2
LCD0_BL_PWM4: J1_Part-.171(LCD0_BL_PWM4) J26.12
MIPI DS0_RESET: J1_Part-.187(MIPI_DSI0_RST) J26.13
MIPI DSI0 BL_EN: J1_Part-.231(MIPI_DSI0_BL_EN) J26.11
MIPI DSI0 POWER_EN: J1_Part-.178(MIPI_DSI0_PWR_EN) J26.9
MIPI DSI0 TP_RESET: J1_Part-.159(MIPI_DSI0_Reset) J26.14
MIPI DSI0_INTERRUPT_IN: J1_Part-.175(MIPI_DSI0_INTERRUPT_IN) J26.10
MIPI_DSI_TX0_CLK_N: J1_Part-.216(MIPI_DSI_TX0_CLKN) J26.23
MIPI_DSI_TX0_CLK_P: J1_Part-.218(MIPI_DSI_TX0_CLKP) J26.22
MIPI_DSI_TX0_D0_N: J1_Part-.206(MIPI_DSI_TX0_D0N) J26.17
MIPI_DSI_TX0_D0_P: J1_Part-.208(MIPI_DSI_TX0_D0P) J26.16
MIPI_DSI_TX0_D1_N: J1_Part-.210(MIPI_DSI_TX0_D1N) J26.20
MIPI_DSI_TX0_D1_P: J1_Part-.212(MIPI_DSI_TX0_D1P) J26.19
MIPI_DSI_TX0_D2_N: J1_Part-.220(MIPI_DSI_TX0_D2N) J26.26
MIPI_DSI_TX0_D2_P: J1_Part-.222(MIPI_DSI_TX0_D2P) J26.25
MIPI_DSI_TX0_D3_N: J1_Part-.224(MIPI_DSI_TX0_D3N) J26.29
MIPI_DSI_TX0_D3_P: J1_Part-.226(MIPI_DSI_TX0_D3P) J26.28
SARADC_VIN2_LCD_ID: R116.1 ; port SARADC_VIN2  [project net SARADC_VIN2]

### Layout directives
differential pair; differential pair class DIFF-MIPI-100; rule Matched Net Lengths [Tolerance = 0.508mm]; rule Impedance Constraint [Min = 90.00    Max = 110.0    ]: MIPI_DSI_TX0_CLK_N, MIPI_DSI_TX0_CLK_P, MIPI_DSI_TX0_D0_N, MIPI_DSI_TX0_D0_P, MIPI_DSI_TX0_D1_N, MIPI_DSI_TX0_D1_P, MIPI_DSI_TX0_D2_N, MIPI_DSI_TX0_D2_P, MIPI_DSI_TX0_D3_N, MIPI_DSI_TX0_D3_P

### Notes on the sheet
- MIPI-DSI DISPLAY
- (near R175) 10K
- (near J26) FireFLY
- DM-M10R800 V2
- 1280x800 IPS LCD
- File:
- Title:
- Date:
- Page
- Num:
- Total:
- Drawn By: Huzaifa Ali
- (in symbol AS0B826-S78B-7H, part N) RockChip - MIPI_DSI0; 14 of 25

### Library data of the parts
C143 C158 = CC0402KRX5R7BB104: CAP CER 0.1UF 16V X5R 0402; Manufacturer: Yageo; Tolerance: 10%; Manufacturer Part Number: CC0402KRX5R7BB104; RoHS: Yes; Category: Ceramic Capacitors; Supplier 1: Mouser; Stock 1: 936792; Pricing 1: 1=0.10000, 10=0.02300, 50=0.02300, 100=0.01100, 1000=0.00600, 10000=0.00400 (USD); Mount: Surface Mount; Case/Package: 0402; Number of Pins: 2; Case Code (Metric): 1005; Case Code (Imperial): 0402; Min Operating Temperature: -55°C; Max Operating Temperature: 85°C; Capacitance: 100nF; Dielectric: X5R; Packaging: Tape and Reel; Voltage Rating: 16V; Package Quantity: 1; Voltage Rating (DC): 16V; Termination: SMD/SMT; Resistor Type: Ceramic; Series: CC; Construction: Flat; Length: 1mm; Width: 0.02inch; Height: 0.5mm; Thickness: 0.022inch; Depth: 0.5mm; Radiation Hardening: No; REACH SVHC: Unknown; Lead Free: Lead Free; Halogen Free: Halogen Free; RoHS Compliant: Yes; ComponentLink1URL: https://datasheet.ciiva.com/155/mlccorderingcode-155879.pdf?src-supplier=Digi-Key; ComponentLink1Description: https://datasheet.ciiva.com/155/mlccorderingcode-155879.pdf?src-supplier=Digi-Key; ComponentLink2URL: https://datasheet.ciiva.com/155/mlccorderingcode-155878.pdf?src-supplier=Digi-Key; ComponentLink2Description: https://datasheet.ciiva.com/155/mlccorderingcode-155878.pdf?src-supplier=Digi-Key; ComponentLink3URL: https://datasheet.ciiva.com/155/mlccorderingcode-155880.pdf?src-supplier=Digi-Key; ComponentLink3Description: https://datasheet.ciiva.com/155/mlccorderingcode-155880.pdf?src-supplier=Digi-Key; ComponentLink4URL: https://datasheet.ciiva.com/11464/upy-gphc-x5r-4v-to-50v-12-11464869.pdf?src-supplier=Avnet; ComponentLink4Description: https://datasheet.ciiva.com/11464/upy-gphc-x5r-4v-to-50v-12-11464869.pdf?src-supplier=Avnet; Supplier Part Number 1: 603-CC402KRX5R7BB104; LCSC Part Number: C106204
C156 C157 = C1608X5R1E106M080AC: CAP CER 10UF 25V X5R 0603; Manufacturer: TDK; Dielectric Material: Ceramic; Tolerance: 20%; Item Type: Capacitor; Supplier 1: Digi-Key; Manufacturer Part Number: C1608X5R1E106M080AC; Stock 1: 61681; Pricing 1: 1=0.96, 10=0.704, 100=0.483, 500=0.38238, 1000=0.322 (USD); Mount: Surface Mount; Case/Package: 0603; Weight: 7.1E-05oz; Case Code (Imperial): 0603; Case Code (Metric): 1608; Min Operating Temperature: -55°C; Max Operating Temperature: 85°C; Capacitance: 10uF; Packaging: Tape and Reel; Voltage Rating: 25V; Voltage Rating (DC): 25V; Termination: SMD/SMT; Package Quantity: 1; Dielectric: X5R; Composition: Ceramic; Length: 1.6mm; Height: 0.8mm; Width: 0.8mm; Thickness: 0.039inch; Depth: 0.8mm; Lead Free: Lead Free; REACH SVHC: No SVHC; Supplier Part Number 1: 445-9015-1-ND; LCSC Part Number: C2168289
J1_Part- = AS0B826-S78B-7H: SMD,P=0.5mm,Surface Mount，Right Angle; Manufacturer: FOXCONN; Item Type: Card Edge Connectors; Supplier: LCSC; Manufacturer Part Number: AS0B826-S78B-7H; RoHS: No; Stock: 4979; Pricing: 1=9.21, 10=8.287, 25=7.8064, 50=7.6064, 100=7.4062 (USD); LCSC Part Number: C426232
J26 = TF31-30S-0.5SH(800): CONN FFC BOTTOM 30POS 0.5MM R/A; Manufacturer: Hirose; Item Type: FFC / FPC Connector; Supplier: Digikey; Supplier Part Number: 26-TF31-30S-0.5SH(800)CT-ND; Manufacturer Part Number: TF31-30S-0.5SH(800); RoHS: Yes; Stock: 14095; Pricing: 1=2.37, 10=2.065, 25=1.9772, 50=1.9332, 100=1.8453, 250=1.66952, 500=1.53772, 1000=1.31805 (USD); ComponentLink1URL: https://www.hirose.com/product/download/?distributor=digikey&amp;type=specSheet&amp;lang=en&amp;num=TF31-30S-0.5SH(800)&src-supplier=Digikey; ComponentLink1Description: https://www.hirose.com/product/download/?distributor=digikey&amp;type=specSheet&amp;lang=en&amp;num=TF31-30S-0.5SH(800)&src-supplier=Digikey; ComponentLink2URL: https://datasheet.octopart.com/TF31-30S-0.5SH%28800%29-Hirose-datasheet-138123803.pdf?src-supplier=Sager+Electronics; ComponentLink2Description: https://datasheet.octopart.com/TF31-30S-0.5SH%28800%29-Hirose-datasheet-138123803.pdf?src-supplier=Sager+Electronics; LCSC Part Number: C5137133
R116 = RC0402FR-070RL: RES 0 OHM JUMPER 1/16W 0402; Manufacturer: Yageo; Power Rating: 62.5mW; Tolerance: 1%; Voltage Rating: 50V; Temperature Coefficient: 200ppm/°C; Max Power Dissipation: 63mW; Supplier 1: Mouser; Manufacturer Part Number: RC0402FR-070RL; RoHS: Yes; Category: Chip SMD Resistors; Stock 1: 8556842; Pricing 1: 1=0.10000, 10=0.01400, 50=0.01400, 100=0.00600, 1000=0.00300, 5000=0.00200, 10000=0.00100 (USD); Case/Package: 0402; Case Code (Imperial): 0402; Case Code (Metric): 1005; Size Code: 0402; Min Operating Temperature: -55°C; Max Operating Temperature: 155°C; Resistor Type: Thick Film; Resistance: 0R; Packaging: Tape and Reel; Termination: SMD/SMT; Features: Moisture Resistant; Series: RC; Number of Terminations: 2; Length: 1mm; Width: 0.5mm; Height: 0.35mm; RoHS Compliant: Yes; Lead Free: Lead Free; ComponentLink1URL: https://datasheet.ciiva.com/8896/pyu-rc0402-51-rohs-l-6-8896149.pdf?src-supplier=Avnet; ComponentLink1Description: https://datasheet.ciiva.com/8896/pyu-rc0402-51-rohs-l-6-8896149.pdf?src-supplier=Avnet; ComponentLink2URL: https://datasheet.ciiva.com/16790/pyu-rc0402-51-rohs-l-6-r-16790444.pdf?src-supplier=Future+Electronics; ComponentLink2Description: https://datasheet.ciiva.com/16790/pyu-rc0402-51-rohs-l-6-r-16790444.pdf?src-supplier=Future+Electronics; Supplier Part Number 1: 603-RC0402FR-070RL; LCSC Part Number: C106231; Mount: Surface Mount; Contact Plating: Tin,Matte; Radiation Hardening: No
R175 = RC0402FR-0710KL: RES 10K OHM 1% 1/16W 0402; Manufacturer: Yageo; Resistance: 10kR; Voltage Rating (DC): 50V; Temperature Coefficient: 100ppm/°C; Power Rating: 62.5mW; Max Power Dissipation: 63mW; Item Type: Resistor; Supplier 1: Mouser; Manufacturer Part Number: RC0402FR-0710KL; RoHS: Yes; Category: Chip SMD Resistors; Stock 1: 18648329; Pricing 1: 1=0.10000, 10=0.01400, 50=0.01400, 100=0.00500, 1000=0.00300, 10000=0.00200 (USD); Case/Package: 0402; Number of Pins: 2; Case Code (Imperial): 0402; Case Code (Metric): 1005; Min Operating Temperature: -55°C; Max Operating Temperature: 155°C; Resistor Type: Thick Film; Tolerance: 1%; Packaging: Tape and Reel; Voltage Rating: 50V; Termination: SMD/SMT; Working Voltage: 50V; Number of Terminations: 2; Features: Moisture Resistant; Series: RC; Resistance Tolerance: 1%; Construction: Rectangular; Length: 1mm; Width: 0.5mm; Height: 0.32mm; Depth: 0.5mm; Lead Pitch: 0.2mm; REACH SVHC: No SVHC; Lead Free: Lead Free; RoHS Compliant: Yes; Military Standard: Not; ComponentLink1URL: https://datasheet.ciiva.com/7660/38568-7660787.pdf?src-supplier=Element14; ComponentLink1Description: https://datasheet.ciiva.com/7660/38568-7660787.pdf?src-supplier=Element14; ComponentLink2URL: https://datasheet.ciiva.com/7849/1686128-7849814.pdf?src-supplier=Element14; ComponentLink2Description: https://datasheet.ciiva.com/7849/1686128-7849814.pdf?src-supplier=Element14; ComponentLink3URL: https://datasheet.ciiva.com/7983/1018594-7983486.pdf?src-supplier=Element14; ComponentLink3Description: https://datasheet.ciiva.com/7983/1018594-7983486.pdf?src-supplier=Element14; ComponentLink4URL: https://datasheet.ciiva.com/22747/1018594-22747512.pdf?src-supplier=Element14; ComponentLink4Description: https://datasheet.ciiva.com/22747/1018594-22747512.pdf?src-supplier=Element14; ComponentLink5URL: https://datasheet.ciiva.com/12667/pyu-rc0402-51-rohs-l-6-r-12667067.pdf?src-supplier=Mouser; ComponentLink5Description: https://datasheet.ciiva.com/12667/pyu-rc0402-51-rohs-l-6-r-12667067.pdf?src-supplier=Mouser; ComponentLink6URL: https://datasheet.ciiva.com/7849/1784430-7849813.pdf?src-supplier=Element14; ComponentLink6Description: https://datasheet.ciiva.com/7849/1784430-7849813.pdf?src-supplier=Element14; ComponentLink7URL: https://datasheet.ciiva.com/7849/1784430-7849815.pdf?src-supplier=Element14; ComponentLink7Description: https://datasheet.ciiva.com/7849/1784430-7849815.pdf?src-supplier=Element14; Supplier Part Number 1: 603-RC0402FR-0710KL; LCSC Part Number: C60490